# Altium schematic sheet RotaryDebouncerTop.SchDoc
size A4; SheetNumber: 1; SheetTotal: 2
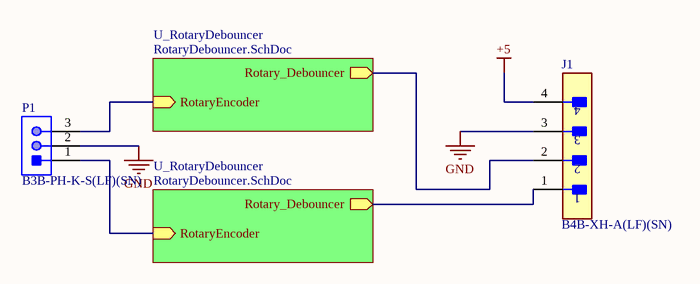
[diagram p0: RotaryDebouncerTop.SchDoc]

## Parts
J1  B4B-XH-A(LF)(SN)  [FP-B4B-XH-A_LF_SN-MFG]
P1  B3B-PH-K-S(LF)(SN)  [JST-B3B-PH-K-S-3_V]

## Sub-sheets
U_RotaryDebouncer = RotaryDebouncer.SchDoc: Rotary_Debouncer (out), RotaryEncoder (in)
U_RotaryDebouncer = RotaryDebouncer.SchDoc: Rotary_Debouncer (out), RotaryEncoder (in)

## Nets
+5: J1.4
GND: J1.3 P1.2
NetJ1_1: J1.1 ; sheet U_RotaryDebouncer/Rotary_Debouncer
NetJ1_2: J1.2 ; sheet U_RotaryDebouncer/Rotary_Debouncer
NetP1_1: P1.1 ; sheet U_RotaryDebouncer/RotaryEncoder
NetP1_3: P1.3 ; sheet U_RotaryDebouncer/RotaryEncoder

## Library data of the parts
J1 = CMP-17439-000250-1: CONN HEADER VERT 4POS 2.5MM; Number of Contacts: 4; Contact Resistance: 20mR; Voltage Rating: 250V; Max Current Rating: 3A; Gender: Male; Wire/Cable Gauge: 22AWG; Mated Stacking Heights: 9.8mm; Insulation Resistance: 1GR; Orientation: Straight; Contact Type: Male Pin; Contact Finish - Mating: TIN; Series: XH; Max Voltage Rating (AC): 250V; Lead Pitch: 2.5mm; Contact Shape: Square; Insulation Color: Natural; Termination: Solder; Lead Free: Lead Free; Voltage Rating (AC): 250V; Number of Rows: 1; Flammability Rating: UL94 V-0; Number of Positions: 4; Max Operating Temperature: 85°C; Package Quantity: 500; Mount: Through Hole; REACH SVHC: No SVHC; Connector Type: Header; Insulation Material: Nylon; Fastening Type: Detent; Min Operating Temperature: -25°C; Housing Color: White; Packaging: Bulk; Contact Plating: Tin; Contact Material: Brass; Max Voltage Rating (DC): 250V; Housing Material: Polyamide; Color: Natural; Material: Polyamide; Pitch: 2.5mm; Depth: 5.75mm; Current Rating: 3A; Length: 12.4mm
P1 = CMP-2000-05164-1: Male Header, Pitch 2 mm, 1 x 3 Position, Height 6 mm, Tail Length 3.4 mm, -25 to 85 degC, RoHS, Bulk; Manufacturer: JST; Style/Orientation: StraightHeader/Plug; Pitch: 2mm; No of Positions: 3; Termination: Crimp; Manufacturer URL: http://www.jst.com/home2.html; Datasheet Version: Oct-06; Type: ShroudedHeader; Datasheet URL: https://datasheet.ciiva.com/11746/0900766b80826550-11746939.pdf